# EAGLE board Doppler_LED_Controller (EAGLE 9.1.3), part 1 of 2
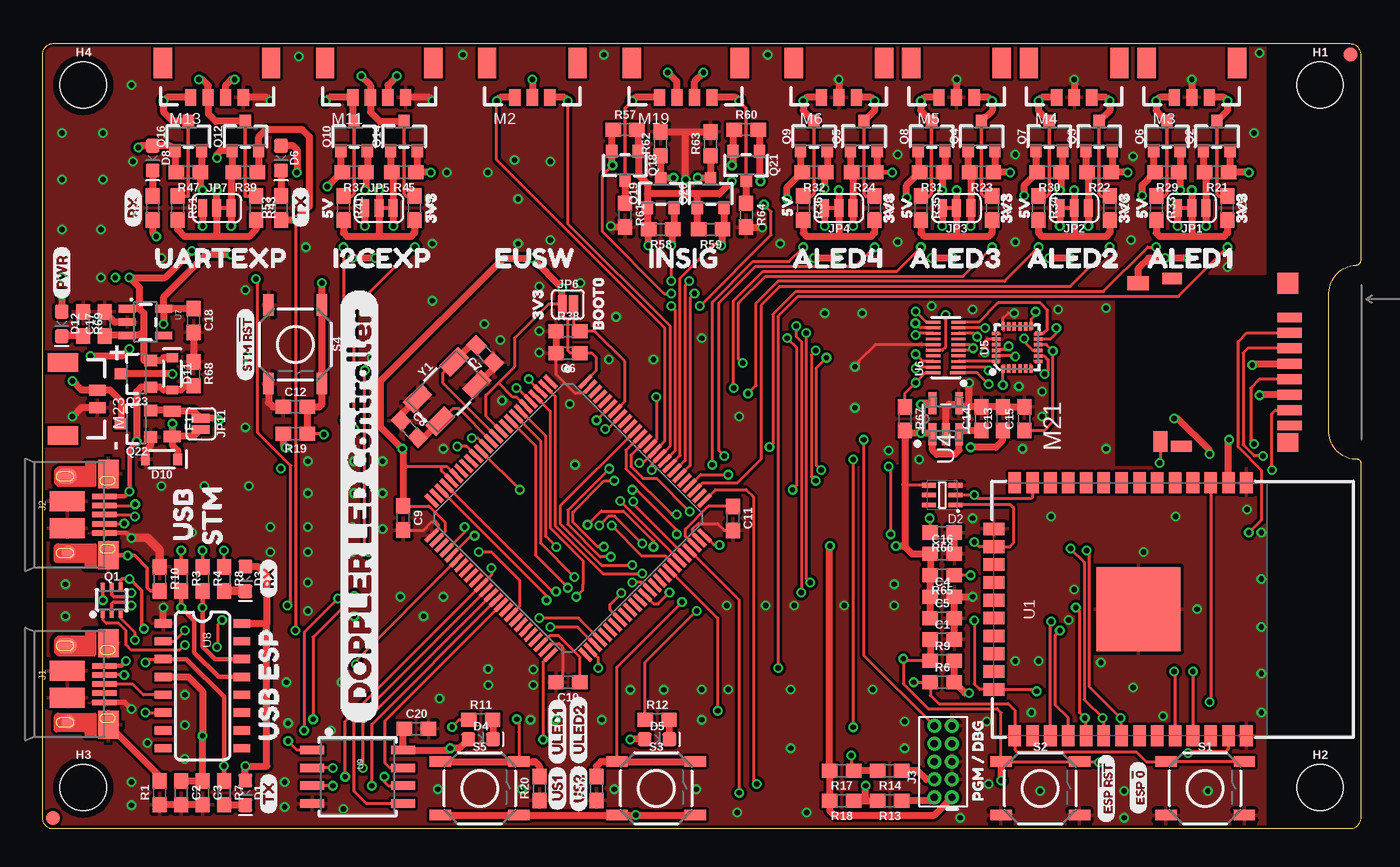
[diagram p7: board, top side]
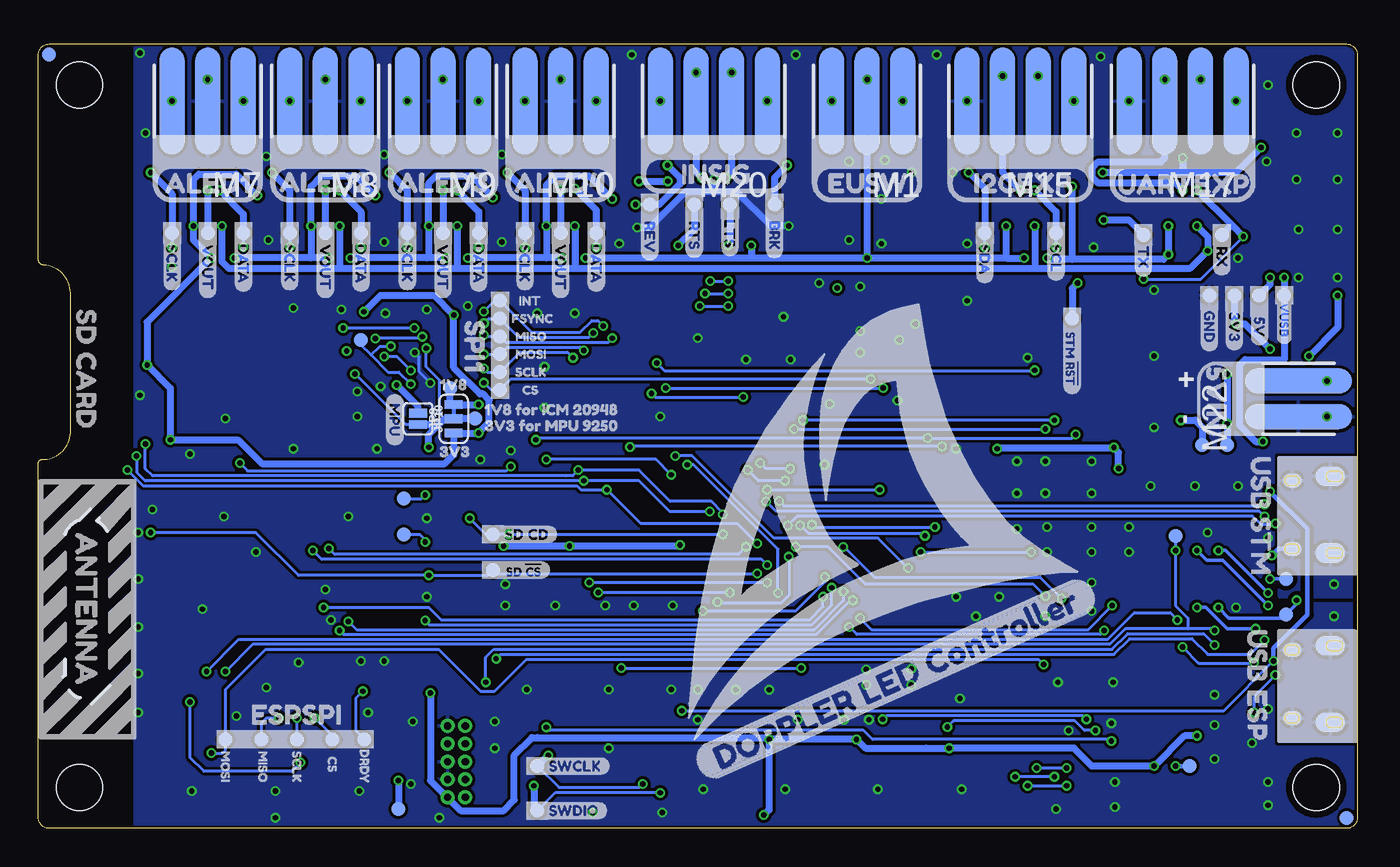
[diagram p8: board, bottom side, seen from below]

Size 93.98 x 55.88 mm. Coordinates in mm from the lower left corner, seen from the top.
Outline: 0.76,0 93.22,0 arc90 93.98,0.76 93.98,26.04 arc90 93.73,26.29 arc-90 91.69,28.19 91.69,37.97 arc-90 93.6,40.13 arc90 93.98,40.51 93.98,55.12 arc90 93.22,55.88 0.76,55.88 arc90 0,55.12 0,0.76 arc90 0.76,0
Copper layers (1*16): Top 0.035mm / dielectric 1.5mm / Bottom 0.035mm
Design rules "SparkFun-2-layer-PCBWay-LIMIT": minimum track width 6mil, minimum drill 0.3mm, track to track 6mil, track to pad 6mil, pad to pad 6mil, via to via 6mil, smd to smd 6mil, copper to edge 6mil, drill to drill 6mil, minimum pad ring 6mil, minimum via ring 6mil, stop-mask expansion 4mil, vias tented up to drill 25mil, thermal gap 10mil

## Footprints (pad centres in the part's own frame; a part is rotated, then mirrored left to right if it is on the bottom)
0603 = smd 1.1 x 1: 1 -0.85,0; 2 0.85,0
LED-0603 = smd 1 x 1: A -0.877,0; C 0.877,0
APA102_2020_LONG = smd 1 x 0.3: 1DIN -0.95,0.7; 2CIN -0.95,0; 5COUT 0.95,0; 6DOUT 0.95,0.7 | smd 1 x 0.35: 3GND -0.95,-0.7; 4VCC 0.95,-0.7
SOD-323 = smd 0.63 x 0.83: A 1.15,0; C -1.15,0
0805 = smd 0.8 x 1.2: 1 -0.9,0; 2 0.9,0
FIDUCIAL-1X2 = smd 1 x 1: 1 0,0
STAND-OFF = hole 3.302: 0,0
USB-MICROB-PTH-MILL = smd 0.4 x 1.75: D+ 0,0; D- -0.65,0; GND 1.3,0; ID 0.65,0; VBUS -1.3,0 | smd 2 x 1.46: SHIELD -2.9,0.275; SHIELD2 2.9,0.275 | smd 1.425 x 2.5: SHIELD3 -0.963,-2.675; SHIELD4 0.963,-2.675 | smd 1.4 x 2.1 bottom: SHIELD5 -2.731,-2.531; SHIELD7 2.729,-2.531 | smd 1 x 1: SHIELD6 2.7,-2.575 | smd 1.1 x 1.5: SHIELD8 -2.731,-2.731 | smd 1 x 1.3 bottom: SHIELD9 -2.43,0.195; SHIELD10 2.43,0.195
2X5-PTH-1.27MM = drill 0.508 pad 1: 1 -2.54,-0.635; 2 -2.54,0.635; 3 -1.27,-0.635; 4 -1.27,0.635; 5 0,-0.635; 6 0,0.635; 7 1.27,-0.635; 8 1.27,0.635; 9 2.54,-0.635; 10 2.54,0.635
SMT-JUMPER_3_1-NC_TRACE_SILK = smd 0.635 x 1.27: 1 -1.016,0; 2 0,0; 3 1.016,0
SMT-JUMPER_2_NO_SILK = smd 0.635 x 1.27: 1 -0.406,0; 2 0.406,0
1X03_SMD_0.1IN = smd 1.778 x 7.62: P$1 -2.54,0; P$2 0,0; P$3 2.54,0
3_PIN_LOCK = smd 1.3 x 2.15: MOUNT0 -3.225,2.46; MOUNT1 3.225,2.46 | smd 0.8 x 1.2: P$1 -1.25,0; P$2 0,0; P$3 1.25,0
4_PIN_LOCK = smd 1.3 x 2.15: MOUNT0 -4.475,2.46; MOUNT1 3.225,2.46 | smd 0.8 x 1.2: P$1 -2.5,0; P$2 -1.25,0; P$3 0,0; P$4 1.25,0
1X04_SMD_0.1IN = smd 1.778 x 7.62: P$1 -3.81,0; P$2 -1.27,0; P$3 1.27,0; P$4 3.81,0
SD_AMPHENOL_PUSH_PULL = smd 1.45 x 1: CD_SW1 -1.125,8.35 | smd 1 x 1.55: CD_SW2 10.15,9.925 | smd 1.3 x 1.5: NC_MOUNT1 -1.2,-0.75 | smd 1.5 x 1.5: NC_MOUNT2 10.15,-0.75 | smd 0.8 x 1.5: NC_MOUNT3 -1.475,6.85 | smd 0.8 x 1.4: NC_MOUNT4 10.475,7.5 | smd 0.7 x 1.75: P$1 7.7,-0.875; P$2 6.6,-0.875; P$3 5.5,-0.875; P$4 4.4,-0.875; P$5 3.3,-0.875; P$6 2.2,-0.875; P$7 1.1,-0.875; P$8 0,-0.875
1X02_SMD_0.1IN = smd 1.778 x 7.62: P$1 -1.27,0; P$2 1.27,0
2_PIN_LOCK = smd 1.3 x 2.15: MOUNT0 -1.975,2.46; MOUNT1 3.225,2.46 | smd 0.8 x 1.2: P$2 0,0; P$3 1.25,0
SC70-6 = smd 0.3 x 0.66: 1 -0.65,-0.92; 2 0,-0.92; 3 0.65,-0.92; 4 0.65,0.92; 5 0,0.92; 6 -0.65,0.92
SOT23-3 = smd 0.8 x 0.9: 1 -0.95,-1; 2 0.95,-1; 3 0,1.1
TACTILE_SWITCH_SMD_5.2MM = smd 1.524 x 0.762: 1 -2.794,1.905; 2 2.794,1.905; 3 -2.794,-1.905; 4 2.794,-1.905
PAD.03X.04 = smd 1.016 x 1.016: P$1 0,0
ESP-WROOM-32 = smd 0.9 x 1.5: 1 7.7,9; 2 6.43,9; 3 5.16,9; 4 3.89,9; 5 2.62,9; 6 1.35,9; 7 0.08,9; 8 -1.19,9; 9 -2.46,9; 10 -3.73,9; 11 -5,9; 12 -6.27,9; 13 -7.54,9; 14 -8.81,9; 25 -8.81,-9; 26 -7.54,-9; 27 -6.27,-9; 28 -5,-9; 29 -3.73,-9; 30 -2.46,-9; 31 -1.19,-9; 32 0.08,-9; 33 1.35,-9; 34 2.62,-9; 35 3.89,-9; 36 5.16,-9; 37 6.43,-9; 38 7.7,-9 | smd 1.5 x 0.9: 15 -10.3,5.715; 16 -10.3,4.445; 17 -10.3,3.175; 18 -10.3,1.905; 19 -10.3,0.635; 20 -10.3,-0.635; 21 -10.3,-1.905; 22 -10.3,-3.175; 23 -10.3,-4.445; 24 -10.3,-5.715 | smd 6 x 6: GND 0,0
LQFP-100 = smd 0.3 x 1.2: P$1 -6,-7.75; P$2 -5.5,-7.75; P$3 -5,-7.75; P$4 -4.5,-7.75; P$5 -4,-7.75; P$6 -3.5,-7.75; P$7 -3,-7.75; P$8 -2.5,-7.75; P$9 -2,-7.75; P$10 -1.5,-7.75; P$11 -1,-7.75; P$12 -0.5,-7.75; P$13 0,-7.75; P$14 0.5,-7.75; P$15 1,-7.75; P$16 1.5,-7.75; P$17 2,-7.75; P$18 2.5,-7.75; P$19 3,-7.75; P$20 3.5,-7.75; P$21 4,-7.75; P$22 4.5,-7.75; P$23 5,-7.75; P$24 5.5,-7.75; P$25 6,-7.75; P$51 6,7.75; P$52 5.5,7.75; P$53 5,7.75; P$54 4.5,7.75; P$55 4,7.75; P$56 3.5,7.75; P$57 3,7.75; P$58 2.5,7.75; P$59 2,7.75; P$60 1.5,7.75; P$61 1,7.75; P$62 0.5,7.75; P$63 0,7.75; P$64 -0.5,7.75; P$65 -1,7.75; P$66 -1.5,7.75; P$67 -2,7.75; P$68 -2.5,7.75; P$69 -3,7.75; P$70 -3.5,7.75; P$71 -4,7.75; P$72 -4.5,7.75; P$73 -5,7.75; P$74 -5.5,7.75; P$75 -6,7.75 | smd 1.2 x 0.3: P$26 7.75,-6; P$27 7.75,-5.5; P$28 7.75,-5; P$29 7.75,-4.5; P$30 7.75,-4; P$31 7.75,-3.5; P$32 7.75,-3; P$33 7.75,-2.5; P$34 7.75,-2; P$35 7.75,-1.5; P$36 7.75,-1; P$37 7.75,-0.5; P$38 7.75,0; P$39 7.75,0.5; P$40 7.75,1; P$41 7.75,1.5; P$42 7.75,2; P$43 7.75,2.5; P$44 7.75,3; P$45 7.75,3.5; P$46 7.75,4; P$47 7.75,4.5; P$48 7.75,5; P$49 7.75,5.5; P$50 7.75,6; P$76 -7.75,6; P$77 -7.75,5.5; P$78 -7.75,5; P$79 -7.75,4.5; P$80 -7.75,4; P$81 -7.75,3.5; P$82 -7.75,3; P$83 -7.75,2.5; P$84 -7.75,2; P$85 -7.75,1.5; P$86 -7.75,1; P$87 -7.75,0.5; P$88 -7.75,0; P$89 -7.75,-0.5; P$90 -7.75,-1; P$91 -7.75,-1.5; P$92 -7.75,-2; P$93 -7.75,-2.5; P$94 -7.75,-3; P$95 -7.75,-3.5; P$96 -7.75,-4; P$97 -7.75,-4.5; P$98 -7.75,-5; P$99 -7.75,-5.5; P$100 -7.75,-6
DDC5 = smd 1.575 x 0.559: 1 -1.092,0.95; 2 -1.092,0; 3 -1.092,-0.95; 4 1.092,-0.95; 5 1.092,0.95
QFN24-3X3 = smd 0.495 x 0.25: 1 -1.552,1; 6 -1.552,-1; 13 1.552,-1; 18 1.552,1 | smd 0.6 x 0.25: 2 -1.5,0.6; 3 -1.5,0.2; 4 -1.5,-0.2; 5 -1.5,-0.6; 14 1.5,-0.6; 15 1.5,-0.2; 16 1.5,0.2; 17 1.5,0.6 | smd 0.25 x 0.495: 7 -1,-1.552; 12 1,-1.552; 19 1,1.552; 24 -1,1.552 | smd 0.25 x 0.6: 8 -0.6,-1.5; 9 -0.2,-1.5; 10 0.2,-1.5; 11 0.6,-1.5; 20 0.6,1.5; 21 0.2,1.5; 22 -0.2,1.5; 23 -0.6,1.5
UFDFN-20 = smd 0.2 x 1.1: 1 -1.8,-0.85 | smd 0.2 x 1: 2 -1.4,-0.9; 3 -1,-0.9; 4 -0.6,-0.9; 5 -0.2,-0.9; 6 0.2,-0.9; 7 0.6,-0.9; 8 1,-0.9; 9 1.4,-0.9; 10 1.8,-0.9; 11 1.8,0.9; 12 1.4,0.9; 13 1,0.9; 14 0.6,0.9; 15 0.2,0.9; 16 -0.2,0.9; 17 -0.6,0.9; 18 -1,0.9; 19 -1.4,0.9; 20 -1.8,0.9
SOT23-5 = smd 0.55 x 1.2: 1 -0.95,-1.3; 2 0,-1.3; 3 0.95,-1.3; 4 0.95,1.3; 5 -0.95,1.3
SO016 = smd 0.6 x 1.2: 1 -4.445,-2.8; 2 -3.175,-2.8; 3 -1.905,-2.8; 4 -0.635,-2.8; 5 0.635,-2.8; 6 1.905,-2.8; 7 3.175,-2.8; 8 4.445,-2.8; 9 4.445,2.8; 10 3.175,2.8; 11 1.905,2.8; 12 0.635,2.8; 13 -0.635,2.8; 14 -1.905,2.8; 15 -3.175,2.8; 16 -4.445,2.8
SOIC-8 = smd 0.61 x 1.702: 1 -1.905,-3.251; 2 -0.635,-3.251; 3 0.635,-3.251; 4 1.905,-3.251; 5 1.905,3.251; 6 0.635,3.251; 7 -0.635,3.251; 8 -1.905,3.251
CRYSTAL-SMD-5X3.2-4PAD = smd 1.9 x 1.1: 1 -1.85,-1.15; 2 1.85,-1.15; 3 1.85,1.15; 4 -1.85,1.15

## Placement (x,y rotation side)
C1  0.1uF  [0603]  64.14,13.46 0 top
C2  2.2uF  [0603]  9.91,2.54 270 top
C3  0.1uF  [0603]  11.43,2.54 270 top
C4  0.1uF  [0603]  64.14,16.51 0 top
C5  10uF  [0603]  64.14,14.99 0 top
C6  0.1uF  [0603]  37.47,33.86 180 top
C7  18pF  [0603]  31.55,33.82 135 top
C8  18pF  [0603]  26.16,28.43 315 top
C9  10uF  [0603]  25.72,22.11 270 top
C10  2.2uF  [0603]  37.47,10.41 180 top
C11  2.2uF  [0603]  49.21,22.09 270 top
C12  0.1uF  [0603]  18.03,30.04 0 top
C13  0.1uF  [0603]  68.45,29.18 90 top
C14  0.1uF  [0603]  66.93,29.18 90 top
C15  0.1uF  [0603]  69.98,29.18 90 top
C16  0.1uF  [0603]  64.14,19.56 0 top
C17  2.2uF  [0603]  4.45,35.94 90 top
C18  2.2uF  [0603]  10.79,36.2 270 top
C20  0.1uF  [0603]  26.67,7.11 0 top
D1  ESPTX-GREEN  [LED-0603]  14.48,2.54 270 top
D2  ESP_STAT  [APA102_2020_LONG]  64.14,23.75 180 top
D3  ESPRX-YELLOW  [LED-0603]  14.48,17.78 270 top
D4  ULED1-BLUE  [LED-0603]  31.24,6.35 0 top
D5  ULED2-WHITE  [LED-0603]  43.81,6.35 0 top
D6  U7TX-GREEN  [LED-0603]  17.02,47.75 270 top
D8  U7RX-YELLOW  [LED-0603]  7.87,47.75 270 top
D10  5.6V  [SOD-323]  8.51,26.29 180 top
D11  3A/10V/280mV  [SOD-323]  9.27,32.38 270 top
D12  PWR-RED  [LED-0603]  1.4,35.94 270 top
F1  PPTC_6V500MA  [0805]  9.27,28.83 270 top
FD1  FIDUCIAL1X2  [FIDUCIAL-1X2]  0.76,0.76 0 top
FD2  FIDUCIAL1X2  [FIDUCIAL-1X2]  93.22,55.12 0 top
FD3  FIDUCIAL1X2  [FIDUCIAL-1X2]  0.76,0.76 0 bottom
FD4  FIDUCIAL1X2  [FIDUCIAL-1X2]  93.22,55.12 0 bottom
H1  STAND-OFF  [STAND-OFF]  91.06,52.96 0 top
H2  STAND-OFF  [STAND-OFF]  91.06,2.92 0 top
H3  STAND-OFF  [STAND-OFF]  2.92,2.92 0 top
H4  STAND-OFF  [STAND-OFF]  2.92,52.96 0 top
J1  [USB-MICROB-PTH-MILL]  4.45,10.29 270 top
J2  [USB-MICROB-PTH-MILL]  4.45,22.35 270 top
J3  CORTEX_DEBUG_PTH  [2X5-PTH-1.27MM]  64.2,4.76 90 top
JP1  ALED1_VOUT_SEL  [SMT-JUMPER_3_1-NC_TRACE_SILK]  81.92,44.2 180 top
JP2  ALED2_VOUT_SEL  [SMT-JUMPER_3_1-NC_TRACE_SILK]  73.53,44.2 180 top
JP3  ALED3_VOUT_SEL  [SMT-JUMPER_3_1-NC_TRACE_SILK]  65.15,44.2 180 top
JP4  ALED4_VOUT_SEL  [SMT-JUMPER_3_1-NC_TRACE_SILK]  56.77,44.2 180 top
JP5  I2C1_VOUT_SEL  [SMT-JUMPER_3_1-NC_TRACE_SILK]  24,44.2 0 top
JP6  JUMPER-SMT_2_NO_SILK  [SMT-JUMPER_2_NO_SILK]  37.47,37.34 0 top
JP7  I2C1_VOUT_SEL  [SMT-JUMPER_3_1-NC_TRACE_SILK]  12.45,44.2 0 top
JP9  IMU_VSEL  [SMT-JUMPER_3_1-NC_TRACE_SILK]  64.39,29.18 90 bottom
JP10  MPU9250  [SMT-JUMPER_2_NO_SILK]  66.93,29.18 270 bottom
JP11  DEFUSE  [SMT-JUMPER_2_NO_SILK]  11.3,28.83 270 top
M1  EXT_SWTCH  [1X03_SMD_0.1IN]  34.92,51.82 180 bottom
M2  EXT_SWTCH  [3_PIN_LOCK]  34.92,52.07 0 top
M3  ALED1_LOCK  [3_PIN_LOCK]  81.92,52.07 0 top
M4  ALED2_LOCK  [3_PIN_LOCK]  73.53,52.07 0 top
M5  ALED3_LOCK  [3_PIN_LOCK]  65.15,52.07 0 top
M6  ALED4_LOCK  [3_PIN_LOCK]  56.77,52.07 0 top
M7  ALED1_SMD  [1X03_SMD_0.1IN]  81.92,51.82 180 bottom
M8  ALED2_SMD  [1X03_SMD_0.1IN]  73.53,51.82 180 bottom
M9  ALED3_SMD  [1X03_SMD_0.1IN]  65.15,51.82 180 bottom
M10  ALED4_SMD  [1X03_SMD_0.1IN]  56.77,51.82 180 bottom
M11  I2C1_LOCK  [4_PIN_LOCK]  24.64,52.07 0 top
M13  U7_LOCK  [4_PIN_LOCK]  13.08,52.07 0 top
M15  I2C1_SMD  [1X04_SMD_0.1IN]  24,51.82 180 bottom
M17  U7_SMD  [1X04_SMD_0.1IN]  12.45,51.82 180 bottom
M19  SIG_IN_LOCK  [4_PIN_LOCK]  46.48,52.07 0 top
M20  SIG_IN_SMD  [1X04_SMD_0.1IN]  45.85,51.82 180 bottom
M21  SD  [SD_AMPHENOL_PUSH_PULL]  88.01,28.7 90 top
M22  [1X02_SMD_0.1IN]  4.19,30.61 90 bottom
M23  [2_PIN_LOCK]  3.94,29.97 90 top
Q1  [SC70-6]  4.95,16.26 0 top
Q2  [SOT23-3]  83.69,49.28 0 top
Q3  [SOT23-3]  75.31,49.28 0 top
Q4  [SOT23-3]  66.93,49.28 0 top
Q5  [SOT23-3]  58.55,49.28 0 top
Q6  [SOT23-3]  80.14,49.28 0 top
Q7  [SOT23-3]  71.75,49.28 0 top
Q8  [SOT23-3]  63.37,49.28 0 top
Q9  [SOT23-3]  54.99,49.28 0 top
Q10  [SOT23-3]  22.23,49.28 0 top
Q12  [SOT23-3]  14.48,49.28 0 top
Q14  [SOT23-3]  25.78,49.28 0 top
Q16  [SOT23-3]  10.41,49.28 0 top
Q18  [SOT23-3]  41.53,47.24 180 top
Q19  [SOT23-3]  44.07,45.21 0 top
Q20  [SOT23-3]  47.62,45.21 0 top
Q21  [SOT23-3]  50.16,47.24 180 top
Q22  4.3A/20V/54mΩ  [SOT23-3]  6.73,28.83 90 top
Q23  4.3A/20V/54mΩ  [SOT23-3]  6.73,32.38 90 top
R1  DNP  [0603]  8.38,2.54 90 top
R3  10k  [0603]  9.91,17.78 270 top
R4  10k  [0603]  11.43,17.78 270 top
R6  10k  [0603]  64.14,10.41 0 top
R7  1k  [0603]  12.95,2.54 270 top
R8  1k  [0603]  12.95,17.78 270 top
R9  10k  [0603]  64.14,11.94 0 top
R10  DNP  [0603]  8.38,17.78 270 top
R11  1k  [0603]  31.24,7.75 0 top
R12  1k  [0603]  43.81,7.75 0 top
R13  20  [0603]  60.39,1.97 180 top
R14  20  [0603]  60.39,4.13 180 top
R16  10k  [0603]  39.5,2.86 90 top
R17  10k  [0603]  56.96,4.13 180 top
R18  10k  [0603]  56.96,1.97 180 top
R19  10k  [0603]  18.03,28.13 180 top
R20  10k  [0603]  35.43,2.86 90 top
R21  10k  [0603]  83.69,46.74 180 top
R22  10k  [0603]  75.31,46.74 180 top
R23  10k  [0603]  66.93,46.74 180 top
R24  10k  [0603]  58.55,46.74 180 top
R25  10k  [0603]  84.45,44.2 270 top
R26  10k  [0603]  76.07,44.2 270 top
R27  10k  [0603]  67.69,44.2 270 top
R28  10k  [0603]  59.31,44.2 270 top
R29  10k  [0603]  80.14,46.74 180 top
R30  10k  [0603]  71.75,46.74 180 top
R31  10k  [0603]  63.37,46.74 180 top
R32  10k  [0603]  54.99,46.74 180 top
R33  10k  [0603]  79.38,44.2 270 top
R34  10k  [0603]  70.99,44.2 270 top
R35  10k  [0603]  62.61,44.2 270 top
R36  10k  [0603]  54.23,44.2 270 top
R37  2.2k  [0603]  22.23,46.74 180 top
R38  10k  [0603]  37.47,35.43 0 top
R39  10k  [0603]  14.48,46.74 180 top
R41  2.2k  [0603]  21.46,44.2 270 top
R43  10k  [0603]  15.24,44.2 270 top
R45  2.2k  [0603]  25.78,46.74 180 top
R47  10k  [0603]  10.41,46.74 180 top
R49  2.2k  [0603]  26.54,44.2 270 top
R51  10k  [0603]  9.65,44.2 270 top
R53  1k  [0603]  17.02,44.2 90 top
R55  1k  [0603]  7.87,44.2 90 top
R57  10k  [0603]  41.53,49.78 0 top
R58  10k  [0603]  44.07,42.67 180 top
R59  10k  [0603]  47.62,42.67 180 top
R60  10k  [0603]  50.16,49.78 0 top
R61  10k  [0603]  41.53,43.69 270 top
R62  10k  [0603]  44.07,48.77 90 top
R63  10k  [0603]  47.62,48.77 90 top
R64  10k  [0603]  50.16,43.69 270 top
R65  10k  [0603]  64.14,18.03 180 top
R66  10k  [0603]  64.14,21.08 180 top
R67  10k  [0603]  61.47,29.18 270 top
R68  10k  [0603]  10.79,32.38 270 top
R69  1k  [0603]  2.92,35.94 270 top
S1  US2  [TACTILE_SWITCH_SMD_5.2MM]  82.87,2.86 0 top
S2  US2  [TACTILE_SWITCH_SMD_5.2MM]  71.12,2.86 0 top
S3  US2  [TACTILE_SWITCH_SMD_5.2MM]  43.75,2.86 0 top
S4  STM_!RST  [TACTILE_SWITCH_SMD_5.2MM]  18.03,34.48 270 top
S5  US1  [TACTILE_SWITCH_SMD_5.2MM]  31.18,2.86 0 top
TP1  EDRDY  [PAD.03X.04]  70.74,6.35 0 bottom
TP3  ERX0  [PAD.03X.04]  12.95,20.83 0 bottom
TP4  ETX0  [PAD.03X.04]  11.94,4.45 0 bottom
TP5  E!RTS  [PAD.03X.04]  5.08,17.78 0 bottom
TP6  E!DTR  [PAD.03X.04]  5.08,15.24 0 bottom
TP7  EMOSI  [PAD.03X.04]  80.64,6.35 0 bottom
TP8  EMISO  [PAD.03X.04]  78.11,6.35 0 bottom
TP9  ESCLK  [PAD.03X.04]  75.56,6.35 0 bottom
TP10  ECS  [PAD.03X.04]  73.03,6.35 0 bottom
TP11  ESSI  [PAD.03X.04]  67.94,20.95 0 bottom
TP12  ESSCK  [PAD.03X.04]  67.94,23.5 0 bottom
TP13  E!RST  [PAD.03X.04]  68.33,1.4 0 bottom
TP17  VDDIO  [PAD.03X.04]  62.87,29.21 0 bottom
TP18  1V8  [PAD.03X.04]  64.64,31.37 0 bottom
TP20  S1Si  [PAD.03X.04]  61.09,33.78 0 bottom
TP21  S1SO  [PAD.03X.04]  61.09,35.05 0 bottom
TP22  S1SCLk  [PAD.03X.04]  61.09,32.51 0 bottom
TP23  CSSD  [PAD.03X.04]  61.59,18.41 270 bottom
TP24  CSIMU  [PAD.03X.04]  61.09,31.24 0 bottom
TP25  SDCD  [PAD.03X.04]  61.59,20.95 270 bottom
TP29  CSIMUIO  [PAD.03X.04]  70.99,34.8 0 bottom
TP30  IMUINT  [PAD.03X.04]  61.09,37.59 0 bottom
TP31  IMUFS  [PAD.03X.04]  61.09,36.32 0 bottom
TP34  AL1D  [PAD.03X.04]  79.38,42.42 0 bottom
TP35  AL2D  [PAD.03X.04]  70.99,42.42 0 bottom
TP36  AL3D  [PAD.03X.04]  62.61,42.42 0 bottom
TP37  AL4D  [PAD.03X.04]  54.23,42.42 0 bottom
TP38  AL1V  [PAD.03X.04]  81.92,42.42 0 bottom
TP39  AL2V  [PAD.03X.04]  73.53,42.42 0 bottom
TP40  AL3V  [PAD.03X.04]  65.15,42.42 0 bottom
TP41  AL4V  [PAD.03X.04]  56.77,42.42 0 bottom
TP42  AL1C  [PAD.03X.04]  84.45,42.42 0 bottom
TP43  AL2C  [PAD.03X.04]  76.07,42.42 0 bottom
TP44  AL3C  [PAD.03X.04]  67.69,42.42 0 bottom
TP45  AL4C  [PAD.03X.04]  59.31,42.42 0 bottom
TP47  VRPP  [PAD.03X.04]  11.05,27.3 270 bottom
TP48  VOVP  [PAD.03X.04]  9.27,27.3 270 bottom
TP49  VUSB  [PAD.03X.04]  5.21,37.97 270 bottom
TP50  5V  [PAD.03X.04]  6.99,37.97 270 bottom
TP51  3V3  [PAD.03X.04]  8.76,37.97 270 bottom
TP52  GND  [PAD.03X.04]  10.54,37.97 270 bottom
TP53  IIC1SDA  [PAD.03X.04]  26.54,42.42 0 bottom
TP54  IIC1SCL  [PAD.03X.04]  21.46,42.42 0 bottom
TP57  U7TX  [PAD.03X.04]  15.24,42.29 0 bottom
TP58  U7RX  [PAD.03X.04]  9.65,42.29 0 bottom
TP62  STMR  [PAD.03X.04]  20.32,36.32 0 bottom
TP68  SWCLK  [PAD.03X.04]  58.42,4.45 0 bottom
TP69  BRK  [PAD.03X.04]  41.53,44.45 0 bottom
TP70  LTS  [PAD.03X.04]  44.7,44.45 0 bottom
TP71  RTS  [PAD.03X.04]  47.24,44.45 0 bottom
TP72  REV  [PAD.03X.04]  50.42,44.45 0 bottom
TP78  SWDIO  [PAD.03X.04]  58.42,1.27 0 bottom
U1  ESP-WROOM-32  [ESP-WROOM-32]  78.11,15.62 0 top
U3  [LQFP-100]  37.47,22.11 225 top
U4  1.8V  [DDC5]  64.39,29.18 90 top
U5  9DoF IMU  [QFN24-3X3]  69.47,34.26 90 top
U6  TXB0108DQSR  [UFDFN-20]  64.39,34.26 90 top
U7  3.3V  [SOT23-5]  7.37,36.07 270 top
U8  CH340C  [SO016]  11.43,10.16 270 top
U9  W25Q32FVSS  [SOIC-8]  22.48,3.68 270 top
U$1  [ALED10]  86.23,45.97 0 bottom
U$2  [ALED21]  78.05,46.05 0 bottom
U$3  [ALED43]  61.32,46.02 0 bottom
U$4  [ALED33]  69.65,46.02 0 bottom
U$5  [INSIG4]  49.48,46.61 0 bottom
U$6  [UARTEXP7]  18.36,45.9 0 bottom
U$7  [I2CEXP6]  28.6,45.97 0 bottom
U$8  [EUSW5]  38.99,45.97 0 bottom
U$9  [SCLK1]  84.45,42.29 270 bottom
U$10  [SCLK1]  76.07,42.29 270 bottom
U$11  [SCLK1]  67.69,42.29 270 bottom
U$12  [SCLK1]  59.31,42.29 270 bottom
U$13  [VOUT2]  81.92,42.29 270 bottom
U$14  [VOUT2]  73.53,42.29 270 bottom
U$15  [VOUT2]  65.15,42.29 270 bottom
U$16  [VOUT2]  56.77,42.29 270 bottom
U$17  [DATA0]  79.38,42.29 270 bottom
U$18  [DATA0]  70.99,42.29 270 bottom
U$19  [DATA0]  62.61,42.29 270 bottom
U$20  [DATA0]  54.23,42.29 270 bottom
U$21  [RTS4]  47.24,43.94 270 bottom
U$22  [LTS3]  44.7,44.07 270 bottom
U$23  [BRK5]  41.53,43.94 270 bottom
U$24  [REV6]  50.42,43.94 270 bottom
U$25  [SCL8]  21.46,42.29 270 bottom
U$26  [SDA7]  26.54,42.29 270 bottom
U$27  [TX9]  15.24,42.16 270 bottom
U$28  [RX10]  9.65,42.16 270 bottom
U$29  [5VIN8]  10.03,34.14 270 bottom
U$30  [VUSB15]  5.21,38.02 270 bottom
U$31  [5V14]  6.96,37.13 270 bottom
U$32  [3V313]  8.76,37.49 270 bottom
U$33  [GND12]  10.54,37.57 270 bottom
U$34  [SWCLK16]  58.29,4.45 0 bottom
U$35  [SWDIO15]  58.29,1.27 0 bottom
U$36  [SCLK20]  75.56,6.1 270 bottom
U$37  [CS21]  73.03,5.71 270 bottom
U$38  [MISO18]  77.98,6.1 270 bottom
U$39  [MOSI17]  80.64,6.1 270 bottom
U$40  [DRDY19]  70.74,6.22 270 bottom
U$41  [ESPSPI9]  80.14,8.13 0 bottom
U$42  [ANTENNA10]  90.55,22.48 270 bottom
U$43  [SD_CARD11]  90.55,38.23 270 bottom
U$44  [USB_ESP12]  7.11,15.49 270 bottom
U$45  [USB_STM13]  6.86,27.81 270 bottom
U$46  [MOSI17]  60.58,33.78 0 bottom
U$47  [MISO18]  60.58,35.05 0 bottom
U$48  [SCLK20]  60.58,32.51 0 bottom
U$49  [CS21]  60.07,31.24 0 bottom
U$50  [FSYNC23]  60.83,36.32 0 bottom
U$51  [INT22]  60.33,37.59 0 bottom
U$52  [STM_#RST26]  20.32,36.2 270 bottom
U$53  [SD_#CS24]  61.47,18.41 0 bottom
U$54  [SD_CD27]  61.47,20.95 0 bottom
U$55  [DOPPLER_LED_CONTROLLER0]  47.12,4.32 24 bottom
U$56  [ULED23]  38.23,4.57 90 top
U$57  [ULED12]  36.7,4.57 90 top
U$58  [US10]  36.7,1.27 90 top
U$59  [US21]  38.23,1.14 90 top
U$60  [ESP_#RST5]  75.82,0.25 90 top
U$61  [ESP_#06]  78.11,0.89 90 top
U$62  [PGM_#_DBG7]  66.67,1.27 90 top
U$63  [TX9]  18.41,42.8 90 top
U$64  [RX10]  6.48,42.8 90 top
U$65  [PWR8]  1.4,37.72 90 top
U$66  [TX9]  16.13,1.02 90 top
U$67  [RX10]  16.13,16.38 90 top
U$68  [DOPPLER_LED_CONTROLLER0]  22.61,7.37 90 top
U$69  [STM_#RST24]  14.48,31.75 90 top
U$71  [USB_ESP12]  16.13,4.95 90 top
U$72  [3V310]  35.31,35.56 90 top
U$73  [BOOT09]  39.62,34.8 90 top
U$74  [ALED10]  77.47,40.64 0 top
U$75  [ALED21]  68.96,40.64 0 top
U$76  [ALED33]  60.58,40.64 0 top
U$77  [ALED42]  52.2,40.64 0 top
U$78  [INSIG4]  41.91,40.64 0 top
U$79  [UARTEXP7]  6.73,40.64 0 top
U$80  [I2CEXP6]  19.43,40.64 0 top
U$81  [EUSW5]  30.99,40.64 0 top
U$82  [3V310]  27.69,42.42 90 top
U$83  [3V310]  60.33,42.42 90 top
U$84  [3V310]  68.71,42.42 90 top
U$85  [3V310]  77.09,42.42 90 top
U$86  [3V310]  85.47,42.42 90 top
U$87  [5V11]  20.32,42.8 90 top
U$88  [5V11]  53.09,42.93 90 top
U$89  [5V11]  61.59,42.8 90 top
U$90  [5V11]  69.98,42.8 90 top
U$91  [5V11]  78.36,42.8 90 top
U$92  [SPI116]  62.87,37.47 270 bottom
U$93  [3V39]  66.09,26.85 0 bottom
U$94  [1V817]  66.04,31.62 0 bottom
U$95  [1V8_FOR_ICM_2094818]  62.87,29.84 0 bottom
U$96  [3V3_FOR_MPU_925019]  62.87,28.7 0 bottom
U$97  [MPU20]  68.58,30.99 270 bottom
U$98  REV_NUM  [REV_NUM]  86.61,43.05 270 bottom
U$99  [USB0]  10.03,19.18 90 top
U$100  [STM1]  12.1,18.95 90 top
Y1  24MHz  [CRYSTAL-SMD-5X3.2-4PAD]  28.86,31.12 45 top